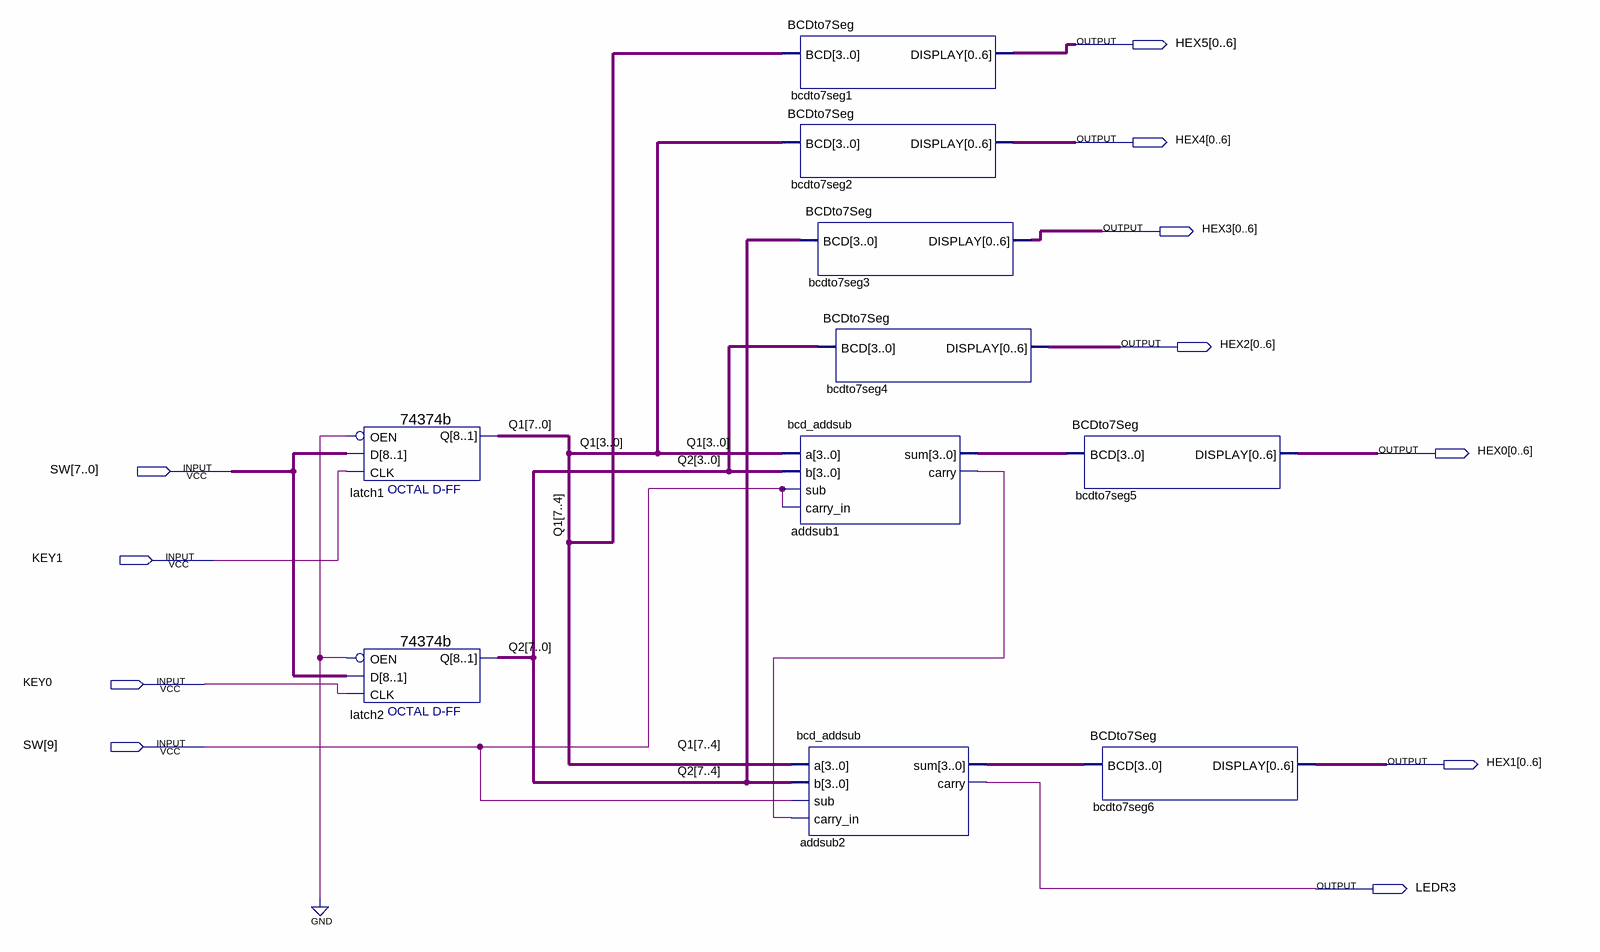
[diagram p0: schematic sheet]
// Quartus schematic 2DigitBCDAddSub.bdf as structural Verilog: 10 symbols, 11 pins
module \2DigitBCDAddSub  (
  input  [9:0] SW,
  input  KEY1,
  input  KEY0,
  output [0:6] HEX5,
  output [0:6] HEX4,
  output [0:6] HEX3,
  output [0:6] HEX2,
  output [0:6] HEX0,
  output [0:6] HEX1,
  output LEDR3
);

  wire addsub1_carry;
  wire [3:0] addsub1_sum, addsub2_sum;
  wire [7:0] Q1, Q2;

  \74374b  latch1 (.D(SW[7:0]), .OEN(1'b0), .CLK(KEY1), .Q(Q1));
  \74374b  latch2 (.D(SW[7:0]), .OEN(1'b0), .CLK(KEY0), .Q(Q2));
  BCDto7Seg bcdto7seg1 (.BCD(Q1[7:4]), .DISPLAY(HEX5));
  BCDto7Seg bcdto7seg2 (.BCD(Q1[3:0]), .DISPLAY(HEX4));
  BCDto7Seg bcdto7seg3 (.BCD(Q2[7:4]), .DISPLAY(HEX3));
  BCDto7Seg bcdto7seg4 (.BCD(Q2[3:0]), .DISPLAY(HEX2));
  bcd_addsub addsub1 (
    .a(Q1[3:0]), .b(Q2[3:0]), .sub(SW[9]), .carry_in(SW[9]), .sum(addsub1_sum), .carry(addsub1_carry));
  bcd_addsub addsub2 (
    .a(Q1[7:4]), .b(Q2[7:4]), .sub(SW[9]), .carry_in(addsub1_carry), .sum(addsub2_sum), .carry(LEDR3));
  BCDto7Seg bcdto7seg5 (.BCD(addsub1_sum), .DISPLAY(HEX0));
  BCDto7Seg bcdto7seg6 (.BCD(addsub2_sum), .DISPLAY(HEX1));
endmodule
